# Altium schematic sheet 05 USB7002-PartB.SchDoc: USB7002 - Part B
size 420 x 297 mm; SheetNumber: 4; SheetTotal: 7
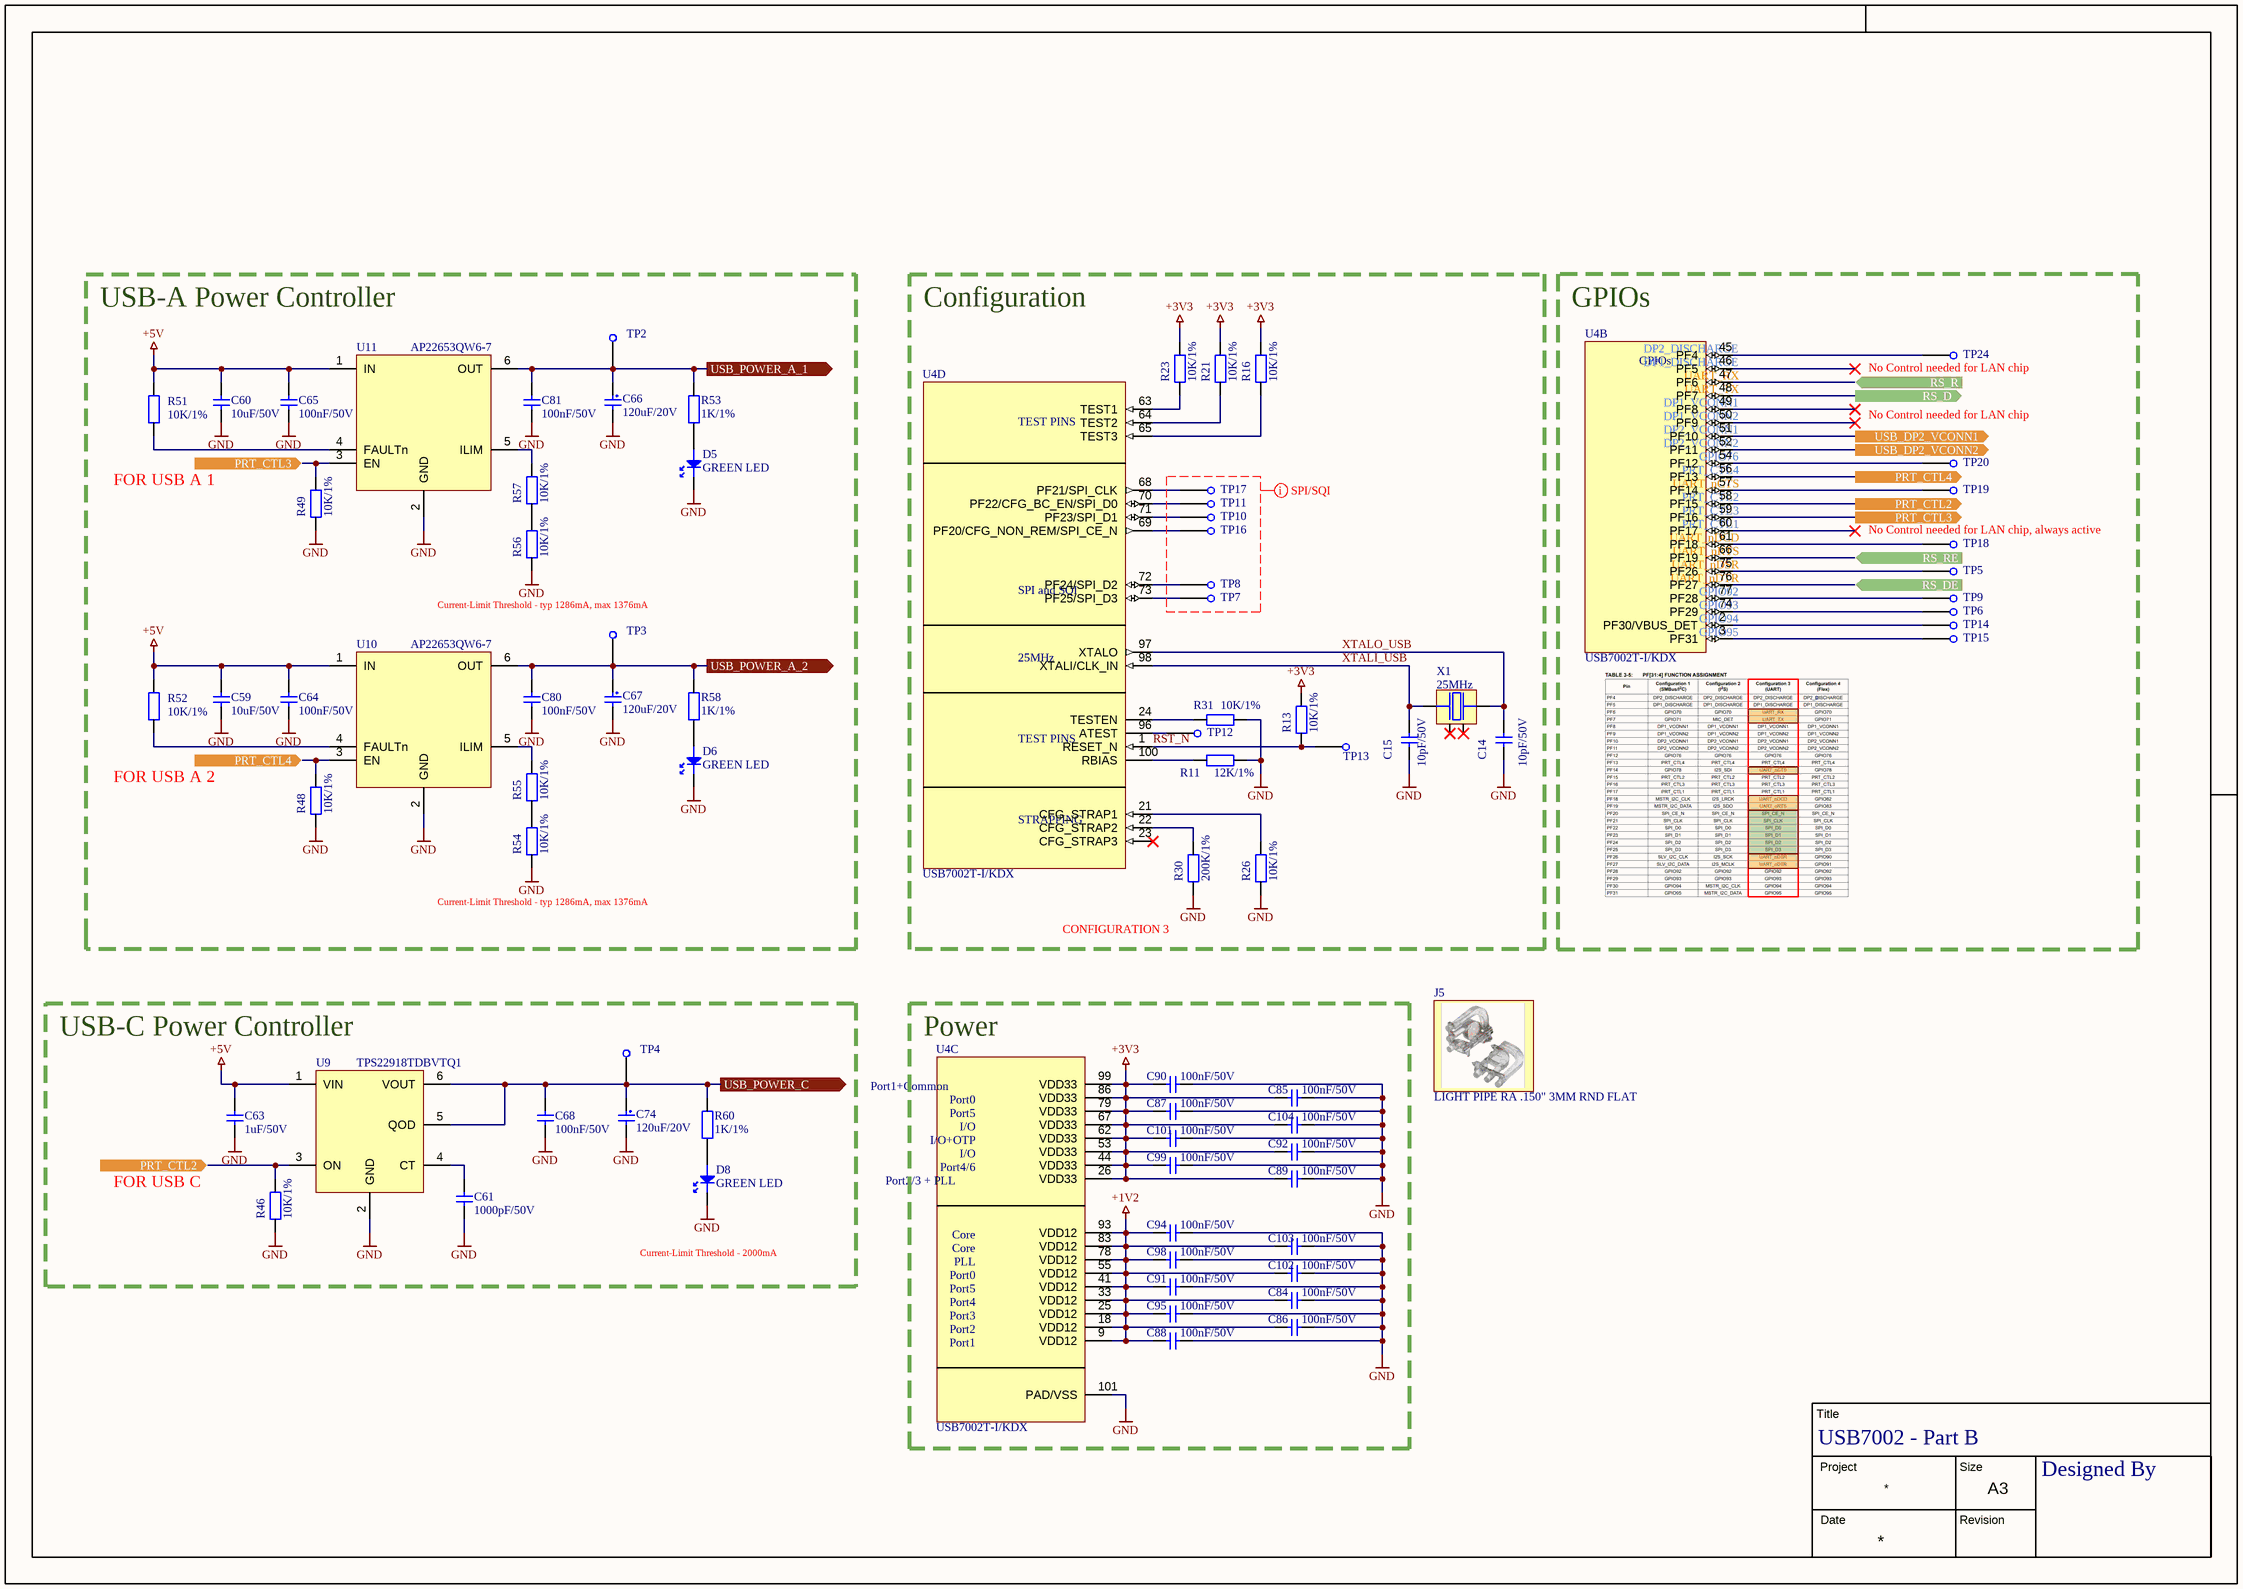
[diagram p0: 05 USB7002-PartB.SchDoc]

## Parts
C14  10pF/50V  [CAPC1005X06N]
C15  10pF/50V  [CAPC1005X06N]
C59  10uF/50V  [CAPC3216X18N]
C60  10uF/50V  [CAPC3216X18N]
C61  1000pF/50V  [CAPC1005X06N]
C63  1uF/50V  [INDC1608X10N]
C64  100nF/50V  [CAPC1005X06N]
C65  100nF/50V  [CAPC1005X06N]
C66  120uF/20V  [CAPAE7366X60M]
C67  120uF/20V  [CAPAE7366X60M]
C68  100nF/50V  [CAPC1005X06N]
C74  120uF/20V  [CAPAE7366X60M]
C80  100nF/50V  [CAPC1005X06N]
C81  100nF/50V  [CAPC1005X06N]
C84  100nF/50V  [CAPC1005X06N]
C85  100nF/50V  [CAPC1005X06N]
C86  100nF/50V  [CAPC1005X06N]
C87  100nF/50V  [CAPC1005X06N]
C88  100nF/50V  [CAPC1005X06N]
C89  100nF/50V  [CAPC1005X06N]
C90  100nF/50V  [CAPC1005X06N]
C91  100nF/50V  [CAPC1005X06N]
C92  100nF/50V  [CAPC1005X06N]
C94  100nF/50V  [CAPC1005X06N]
C95  100nF/50V  [CAPC1005X06N]
C98  100nF/50V  [CAPC1005X06N]
C99  100nF/50V  [CAPC1005X06N]
C101  100nF/50V  [CAPC1005X06N]
C102  100nF/50V  [CAPC1005X06N]
C103  100nF/50V  [CAPC1005X06N]
C104  100nF/50V  [CAPC1005X06N]
D5  GREEN LED  [DIOC1608X06L]
D6  GREEN LED  [DIOC1608X06L]
D8  GREEN LED  [DIOC1608X06L]
J5  LIGHT PIPE RA .150" 3MM RND FLAT  [5151064F]
R11  12K/1%  [RESC1005X04N]
R13  10K/1%  [RESC1005X04N]
R16  10K/1%  [RESC1005X04N]
R21  10K/1%  [RESC1005X04N]
R23  10K/1%  [RESC1005X04N]
R26  10K/1%  [RESC1005X04N]
R30  200K/1%  [RESC1005X04N]
R31  10K/1%  [RESC1005X04N]
R46  10K/1%  [RESC1005X04N]
R48  10K/1%  [RESC1005X04N]
R49  10K/1%  [RESC1005X04N]
R51  10K/1%  [RESC1005X04N]
R52  10K/1%  [RESC1005X04N]
R53  1K/1%  [RESC1005X04N]
R54  10K/1%  [RESC1005X04N]
R55  10K/1%  [RESC1005X04N]
R56  10K/1%  [RESC1005X04N]
R57  10K/1%  [RESC1005X04N]
R58  1K/1%  [RESC1005X04N]
R60  1K/1%  [RESC1005X04N]
TP2  Test Point 1mm  [TEST_POINT_1mm]  (value not drawn)
TP3  Test Point 1mm  [TEST_POINT_1mm]  (value not drawn)
TP4  Test Point 1mm  [TEST_POINT_1mm]  (value not drawn)
TP5  Test Point 1mm  [TEST_POINT_1mm]  (value not drawn)
TP6  Test Point 1mm  [TEST_POINT_1mm]  (value not drawn)
TP7  Test Point 1mm  [TEST_POINT_1mm]  (value not drawn)
TP8  Test Point 1mm  [TEST_POINT_1mm]  (value not drawn)
TP9  Test Point 1mm  [TEST_POINT_1mm]  (value not drawn)
TP10  Test Point 1mm  [TEST_POINT_1mm]  (value not drawn)
TP11  Test Point 1mm  [TEST_POINT_1mm]  (value not drawn)
TP12  Test Point 1mm  [TEST_POINT_1mm]  (value not drawn)
TP13  Test Point 1mm  [TEST_POINT_1mm]  (value not drawn)
TP14  Test Point 1mm  [TEST_POINT_1mm]  (value not drawn)
TP15  Test Point 1mm  [TEST_POINT_1mm]  (value not drawn)
TP16  Test Point 1mm  [TEST_POINT_1mm]  (value not drawn)
TP17  Test Point 1mm  [TEST_POINT_1mm]  (value not drawn)
TP18  Test Point 1mm  [TEST_POINT_1mm]  (value not drawn)
TP19  Test Point 1mm  [TEST_POINT_1mm]  (value not drawn)
TP20  Test Point 1mm  [TEST_POINT_1mm]  (value not drawn)
TP24  Test Point 1mm  [TEST_POINT_1mm]  (value not drawn)
U4  USB7002T-I/KDX  [QFN40P1200X1200X90_HS-101N]  (parts B,C,D of 5)
U9  TPS22918TDBVTQ1  [SOT95P280X145-6N]
U10  AP22653QW6-7  [SOT95P280X145-6N-1]
U11  AP22653QW6-7  [SOT95P280X145-6N-1]
X1  25MHz  [XRCGB25M000F3M00R0]

## Blocks framed on the sheet
USB-A Power Controller: C59 C60 C64-C67 C80 C81 D5 D6 R48 R49 R51-R58 TP2 TP3 U10 U11
Configuration: C14 C15 R11 R13 R16 R21 R23 R26 R30 R31 TP7 TP8 TP10-TP13 TP16 TP17 U4 X1
GPIOs: TP5 TP6 TP9 TP14 TP15 TP18-TP20 TP24 U4
USB-C Power Controller: C61 C63 C68 C74 D8 R46 R60 TP4 U9
Power: C84-C92 C94 C95 C98 C99 C101-C104 U4

## Ports
PRT_CTL2 (in), PRT_CTL2 (out), PRT_CTL3 (in), PRT_CTL3 (out), PRT_CTL4 (in), PRT_CTL4 (out), RS_D (out), RS_DE (in), RS_R (in), RS_RE (in), USB_DP2_VCONN1 (out), USB_DP2_VCONN2 (out), USB_POWER_A_1 (out), USB_POWER_A_2 (out), USB_POWER_C (out)

## Nets
+1V2: C84.2 C86.2 C88.2 C91.2 C94.2 C95.2 C98.2 C102.2 C103.2 U4.9(VDD12) U4.18(VDD12) U4.25(VDD12) U4.33(VDD12) U4.41(VDD12) U4.55(VDD12) U4.78(VDD12) U4.83(VDD12) U4.93(VDD12)
+3V3: C85.2 C87.2 C89.2 C90.2 C92.2 C99.2 C101.2 C104.2 R13.1 R16.1 R21.1 R23.1 U4.26(VDD33) U4.44(VDD33) U4.53(VDD33) U4.62(VDD33) U4.67(VDD33) U4.79(VDD33) U4.86(VDD33) U4.99(VDD33)
+5V: C59.2 C60.2 C63.2 C64.1 C65.1 R51.1 R52.1 U9.1(VIN) U10.1(IN) U11.1(IN)
GND: C14.1 C15.1 C59.1 C60.1 C61.1 C63.1 C64.2 C65.2 C66.2 C67.2 C68.2 C74.2 C80.2 C81.2 C84.1 C85.1 C86.1 C87.1 C88.1 C89.1 C90.1 C91.1 C92.1 C94.1 C95.1 C98.1 C99.1 C101.1 C102.1 C103.1 C104.1 D5.1 D6.1 D8.1 R11.1 R26.2 R30.1 R31.1 R46.2 R48.2 R49.2 R54.2 R56.2 U4.101(PAD/VSS) U9.2(GND) U10.2(GND) U11.2(GND)
PRT_CTL2: R46.1 U4.58(PF15) U9.3(ON) ; port PRT_CTL2
PRT_CTL3: R49.1 U4.59(PF16) U11.3(EN) ; port PRT_CTL3
PRT_CTL4: R48.1 U4.56(PF13) U10.3(EN) ; port PRT_CTL4
RS_D: U4.48(PF7) ; port RS_D
RS_DE: U4.76(PF27) ; port RS_DE
RS_R: U4.47(PF6) ; port RS_R
RS_RE: U4.66(PF19) ; port RS_RE
RST_N: R13.2 TP13.1 U4.1(RESET_N)
USB_DP2_VCONN1: U4.51(PF10) ; port USB_DP2_VCONN1
USB_DP2_VCONN2: U4.52(PF11) ; port USB_DP2_VCONN2
USB_POWER_A_1: C66.1 C81.1 R53.2 TP2.1 U11.6(OUT) ; port USB_POWER_A_1
USB_POWER_A_2: C67.1 C80.1 R58.2 TP3.1 U10.6(OUT) ; port USB_POWER_A_2
USB_POWER_C: C68.1 C74.1 R60.2 TP4.1 U9.5(QOD) U9.6(VOUT) ; port USB_POWER_C
XTALI_USB: C15.2 U4.98(XTALI/CLK_IN) X1.1
XTALO_USB: C14.2 U4.97(XTALO) X1.3
NetC61_2: C61.2 U9.4(CT)
NetD5_2: D5.2 R53.1
NetD6_2: D6.2 R58.1
NetD8_2: D8.2 R60.1
NetR11_2: R11.2 U4.100(RBIAS)
NetR16_2: R16.2 U4.65(TEST3)
NetR21_2: R21.2 U4.64(TEST2)
NetR23_2: R23.2 U4.63(TEST1)
NetR26_1: R26.1 U4.21(CFG_STRAP1)
NetR30_2: R30.2 U4.22(CFG_STRAP2)
NetR31_2: R31.2 U4.24(TESTEN)
NetR51_2: R51.2 U11.4(FAULTn)
NetR52_2: R52.2 U10.4(FAULTn)
NetR54_1: R54.1 R55.2
NetR55_1: R55.1 U10.5(ILIM)
NetR56_1: R56.1 R57.2
NetR57_1: R57.1 U11.5(ILIM)
NetTP5_1: TP5.1 U4.75(PF26)
NetTP6_1: TP6.1 U4.74(PF29)
NetTP7_1: TP7.1 U4.73(PF25/SPI_D3)
NetTP8_1: TP8.1 U4.72(PF24/SPI_D2)
NetTP9_1: TP9.1 U4.77(PF28)
NetTP10_1: TP10.1 U4.71(PF23/SPI_D1)
NetTP11_1: TP11.1 U4.70(PF22/CFG_BC_EN/SPI_D0)
NetTP12_1: TP12.1 U4.96(ATEST)
NetTP14_1: TP14.1 U4.2(PF30/VBUS_DET)
NetTP15_1: TP15.1 U4.3(PF31)
NetTP16_1: TP16.1 U4.69(PF20/CFG_NON_REM/SPI_CE_N)
NetTP17_1: TP17.1 U4.68(PF21/SPI_CLK)
NetTP18_1: TP18.1 U4.61(PF18)
NetTP19_1: TP19.1 U4.57(PF14)
NetTP20_1: TP20.1 U4.54(PF12)
NetTP24_1: TP24.1 U4.45(PF4)

Not connected (* = marked no-connect by the designer): U4 23(CFG_STRAP3)* 46(PF5)* 49(PF8)* 50(PF9)* 60(PF17)*; X1 2* 4*

## Layout directives
net class SPI/SQI: (no net found under the mark)

## Notes on the sheet
- (near U4) DP2_DISCHARGE
- (near U4) DP1_DISCHARGE
- (near U4) UART_RX
- (near U4) UART_TX
- (near U4) DP1_VCONN1
- (near TP24) No Control needed for LAN chip
- (near U4) DP1_VCONN2
- (near U4) DP2_VCONN1
- (near U4) DP2_VCONN2
- (near U4) GPIO76
- No Control needed for LAN chip
- FOR USB A 1
- (near U4) PRT_CTL4
- (near U4) UART_nCTS
- (near U4) PRT_CTL2
- (near U4) PRT_CTL3
- (near U4) PRT_CTL1
- (near U4) UART_nDCD
- (near TP18) No Control needed for LAN chip, always active
- (near U4) UART_nRTS
- (near U4) UART_nDSR
- (near U4) UART_nDTR
- (near U4) GPIO92
- Current-Limit Threshold - typ 1286mA, max 1376mA
- (near U4) GPIO93
- (near U4) GPIO94
- (near U4) GPIO95
- FOR USB A 2
- (near R54) Current-Limit Threshold - typ 1286mA, max 1376mA
- CONFIGURATION 3
- FOR USB C
- Current-Limit Threshold - 2000mA
- Title
- Project
- Size
- Date
- Revision
- A3
- Designed By
- (in symbol USB7002T-I/KDX, part B) GPIOs
- (in symbol USB7002T-I/KDX, part C) Port1+Common; Port0; Port5; I/O; I/O+OTP; Port4/6; Port2/3 + PLL; Core; PLL; Port4; Port3; Port2; Port1
- (in symbol USB7002T-I/KDX, part D) TEST PINS; SPI and SQI; 25MHz; STRAPPING

## Library data of the parts
C14 C15 = GCM1555C1H100JA16D: 10 pF ±5% 50V Ceramic Capacitor C0G, NP0 0402 (1005 Metric); manufacturer: Murata Electronics; mfr_part_number: GCM1555C1H100JA16D; assembler_number: GCM1555C1H100JA16D; datasheet: https://www.murata.com/-/media/webrenewal/support/library/catalog/products/k35e.ashx?la=en-us&cvid=20200508021757000000
C59 C60 = GRT31CR61H106ME01L: 10 µF ±20% 50V Ceramic Capacitor X5R 1206 (3216 Metric); manufacturer: Murata Electronics; mfr_part_number: GRT31CR61H106ME01L; assembler_number: GRT31CR61H106ME01L; datasheet: https://search.murata.co.jp/Ceramy/image/img/A01X/G101/ENG/GRT31CR61H106ME01-01.pdf
C61 = C0402C102K5RECAUTO: 1000 pF ±10% 50V Ceramic Capacitor X7R 0402 (1005 Metric); manufacturer: KEMET; mfr_part_number: C0402C102K5RECAUTO; assembler_number: C0402C102K5RECAUTO; datasheet: https://connect.kemet.com:7667/gateway/IntelliData-ComponentDocumentation/1.0/download/datasheet/C0402C102K5RECAUTO
C63 = GRT188R61H105KE13D: 1 µF ±10% 50V Ceramic Capacitor X5R 0603 (1608 Metric); manufacturer: Murata Electronics; mfr_part_number: GRT188R61H105KE13D; assembler_number: GRT188R61H105KE13D; datasheet: https://search.murata.co.jp/Ceramy/image/img/A01X/G101/ENG/GRT188R61H105KE13-01.pdf
C64 C65 C68 C80 C81 C84-C92 C94 C95 C98 C99 C101-C104 = GCM155R71H104KE02J: 0.1 µF ±10% 50V Ceramic Capacitor X7R 0402 (1005 Metric); manufacturer: Murata Electronics; mfr_part_number: GCM155R71H104KE02J; assembler_number: GCM155R71H104KE02J; datasheet: https://search.murata.co.jp/Ceramy/image/img/A01X/G101/ENG/GCM155R71H104KE02-01.pdf
C66 C67 C74 = A768EB127M1DLAS034: 120 µF 20 V Aluminum - Polymer Capacitors Radial, Can - SMD 34mOhm 2000 Hrs @ 125°C; manufacturer: KEMET; mfr_part_number: A768EB127M1DLAS034; assembler_number: A768EB127M1DLAS034; datasheet: https://connect.kemet.com:7667/gateway/IntelliData-ComponentDocumentation/1.0/download/datasheet/A768EB127M1DLAS034
D5 D6 D8 = LTST-C191KGKT: White 0402 Light Emitting Diodes (LED) RoHS; manufacturer: Lite-On Inc.; mfr_part_number: LTST-C191KGKT; assembler_number: LTST-C191KGKT; datasheet: https://optoelectronics.liteon.com/upload/download/DS22-2000-228/LTST-C191KGKT.PDF
J5 = 5151064F: Light Pipe 3 High Clear Rigid Board Mount, Press Fit, Right Angle; manufacturer: Dialight; mfr_part_number: 5151064F; assembler_number: 5151064F; datasheet: https://s3-us-west-2.amazonaws.com/catsy.557/Lightpipe_Selector_Guide_D.pdf
R11 = ERJ-2RKF1202X: 12 kOhms ±1% 0.1W, 1/10W Chip Resistor 0402 (1005 Metric) Automotive AEC-Q200 Thick Film; manufacturer: Panasonic Electronic Components; mfr_part_number: ERJ-2RKF1202X; assembler_number: ERJ-2RKF1202X; datasheet: https://industrial.panasonic.com/cdbs/www-data/pdf/RDA0000/AOA0000C304.pdf
R13 R16 R21 R23 R26 R31 R46 R48 R49 R51 R52 R54-R57 = RMCF0402FT10K0: 10 kOhms ±1% 0.063W, 1/16W Chip Resistor 0402 (1005 Metric) Automotive AEC-Q200 Thick Film; manufacturer: Stackpole Electronics Inc; mfr_part_number: RMCF0402FT10K0; assembler_number: RMCF0402FT10K0; datasheet: https://www.seielect.com/Catalog/SEI-RMCF_RMCP.pdf
R30 = RMCF0402FT200K: 200 kOhms ±1% 0.063W, 1/16W Chip Resistor 0402 (1005 Metric) Automotive AEC-Q200 Thick Film; manufacturer: Stackpole Electronics Inc; mfr_part_number: RMCF0402FT200K; assembler_number: RMCF0402FT200K; datasheet: https://www.seielect.com/Catalog/SEI-RMCF_RMCP.pdf
R53 R58 R60 = RMCF0402FT1K00: 1 kOhms ±1% 0.063W, 1/16W Chip Resistor 0402 (1005 Metric) Automotive AEC-Q200 Thick Film; manufacturer: Stackpole Electronics Inc; mfr_part_number: RMCF0402FT1K00; assembler_number: RMCF0402FT1K00; datasheet: https://www.seielect.com/Catalog/SEI-RMCF_RMCP.pdf
TP2-TP20 TP24 = TestPoint
U4 = USB7002T-I/KDX: USB Hub Controller USB 3.1 USB Interface 100-VQFN (12x12); manufacturer: Microchip Technology; mfr_part_number: USB7002T-I/KDX; assembler_number: USB7002T-I/KDX; datasheet: https://ww1.microchip.com/downloads/en/DeviceDoc/USB7002-Data-Sheet-DS00002670F.pdf
U9 = TPS22918TDBVTQ1: Power Switch/Driver 1:1 N-Channel 2A SOT-23-6; manufacturer: Texas Instruments; mfr_part_number: TPS22918TDBVTQ1; assembler_number: TPS22918TDBVTQ1; datasheet: https://www.ti.com/general/docs/suppproductinfo.tsp?distId=10&gotoUrl=https%3A%2F%2Fwww.ti.com%2Flit%2Fgpn%2Ftps22918-q1
U10 U11 = AP22653QW6-7: Power Switch/Driver 1:1 N-Channel 1.2A SOT-26 (Type A1); manufacturer: Diodes Incorporated; mfr_part_number: AP22653QW6-7; assembler_number: AP22653QW6-7; datasheet: https://www.diodes.com/assets/Datasheets/AP22653Q.pdf
X1 = XRCGB25M000F3M00R0: 25 MHz ±30ppm Crystal 6pF 150 Ohms 4-SMD, No Lead; manufacturer: Murata Electronics; mfr_part_number: XRCGB25M000F3M00R0; assembler_number: XRCGB25M000F3M00R0; datasheet: https://www.murata.com/~/media/webrenewal/campaign/ads/america/timing/p79e.ashx?la=en-us